# EasyEDA Pro project TFT_F1_2025-05-25_16-21-43.eprj

# Schematic Schematic1
Board Name: Board1; Create Date: 2025-05-25; Page Name: P1; Project Name: TFT_F1_2025-05-25_16-21-43; Schematic Name: Schematic1; Update Date: 2025-05-25; Company: 嘉立创EDA; Page Size: A4; Version: V1.0
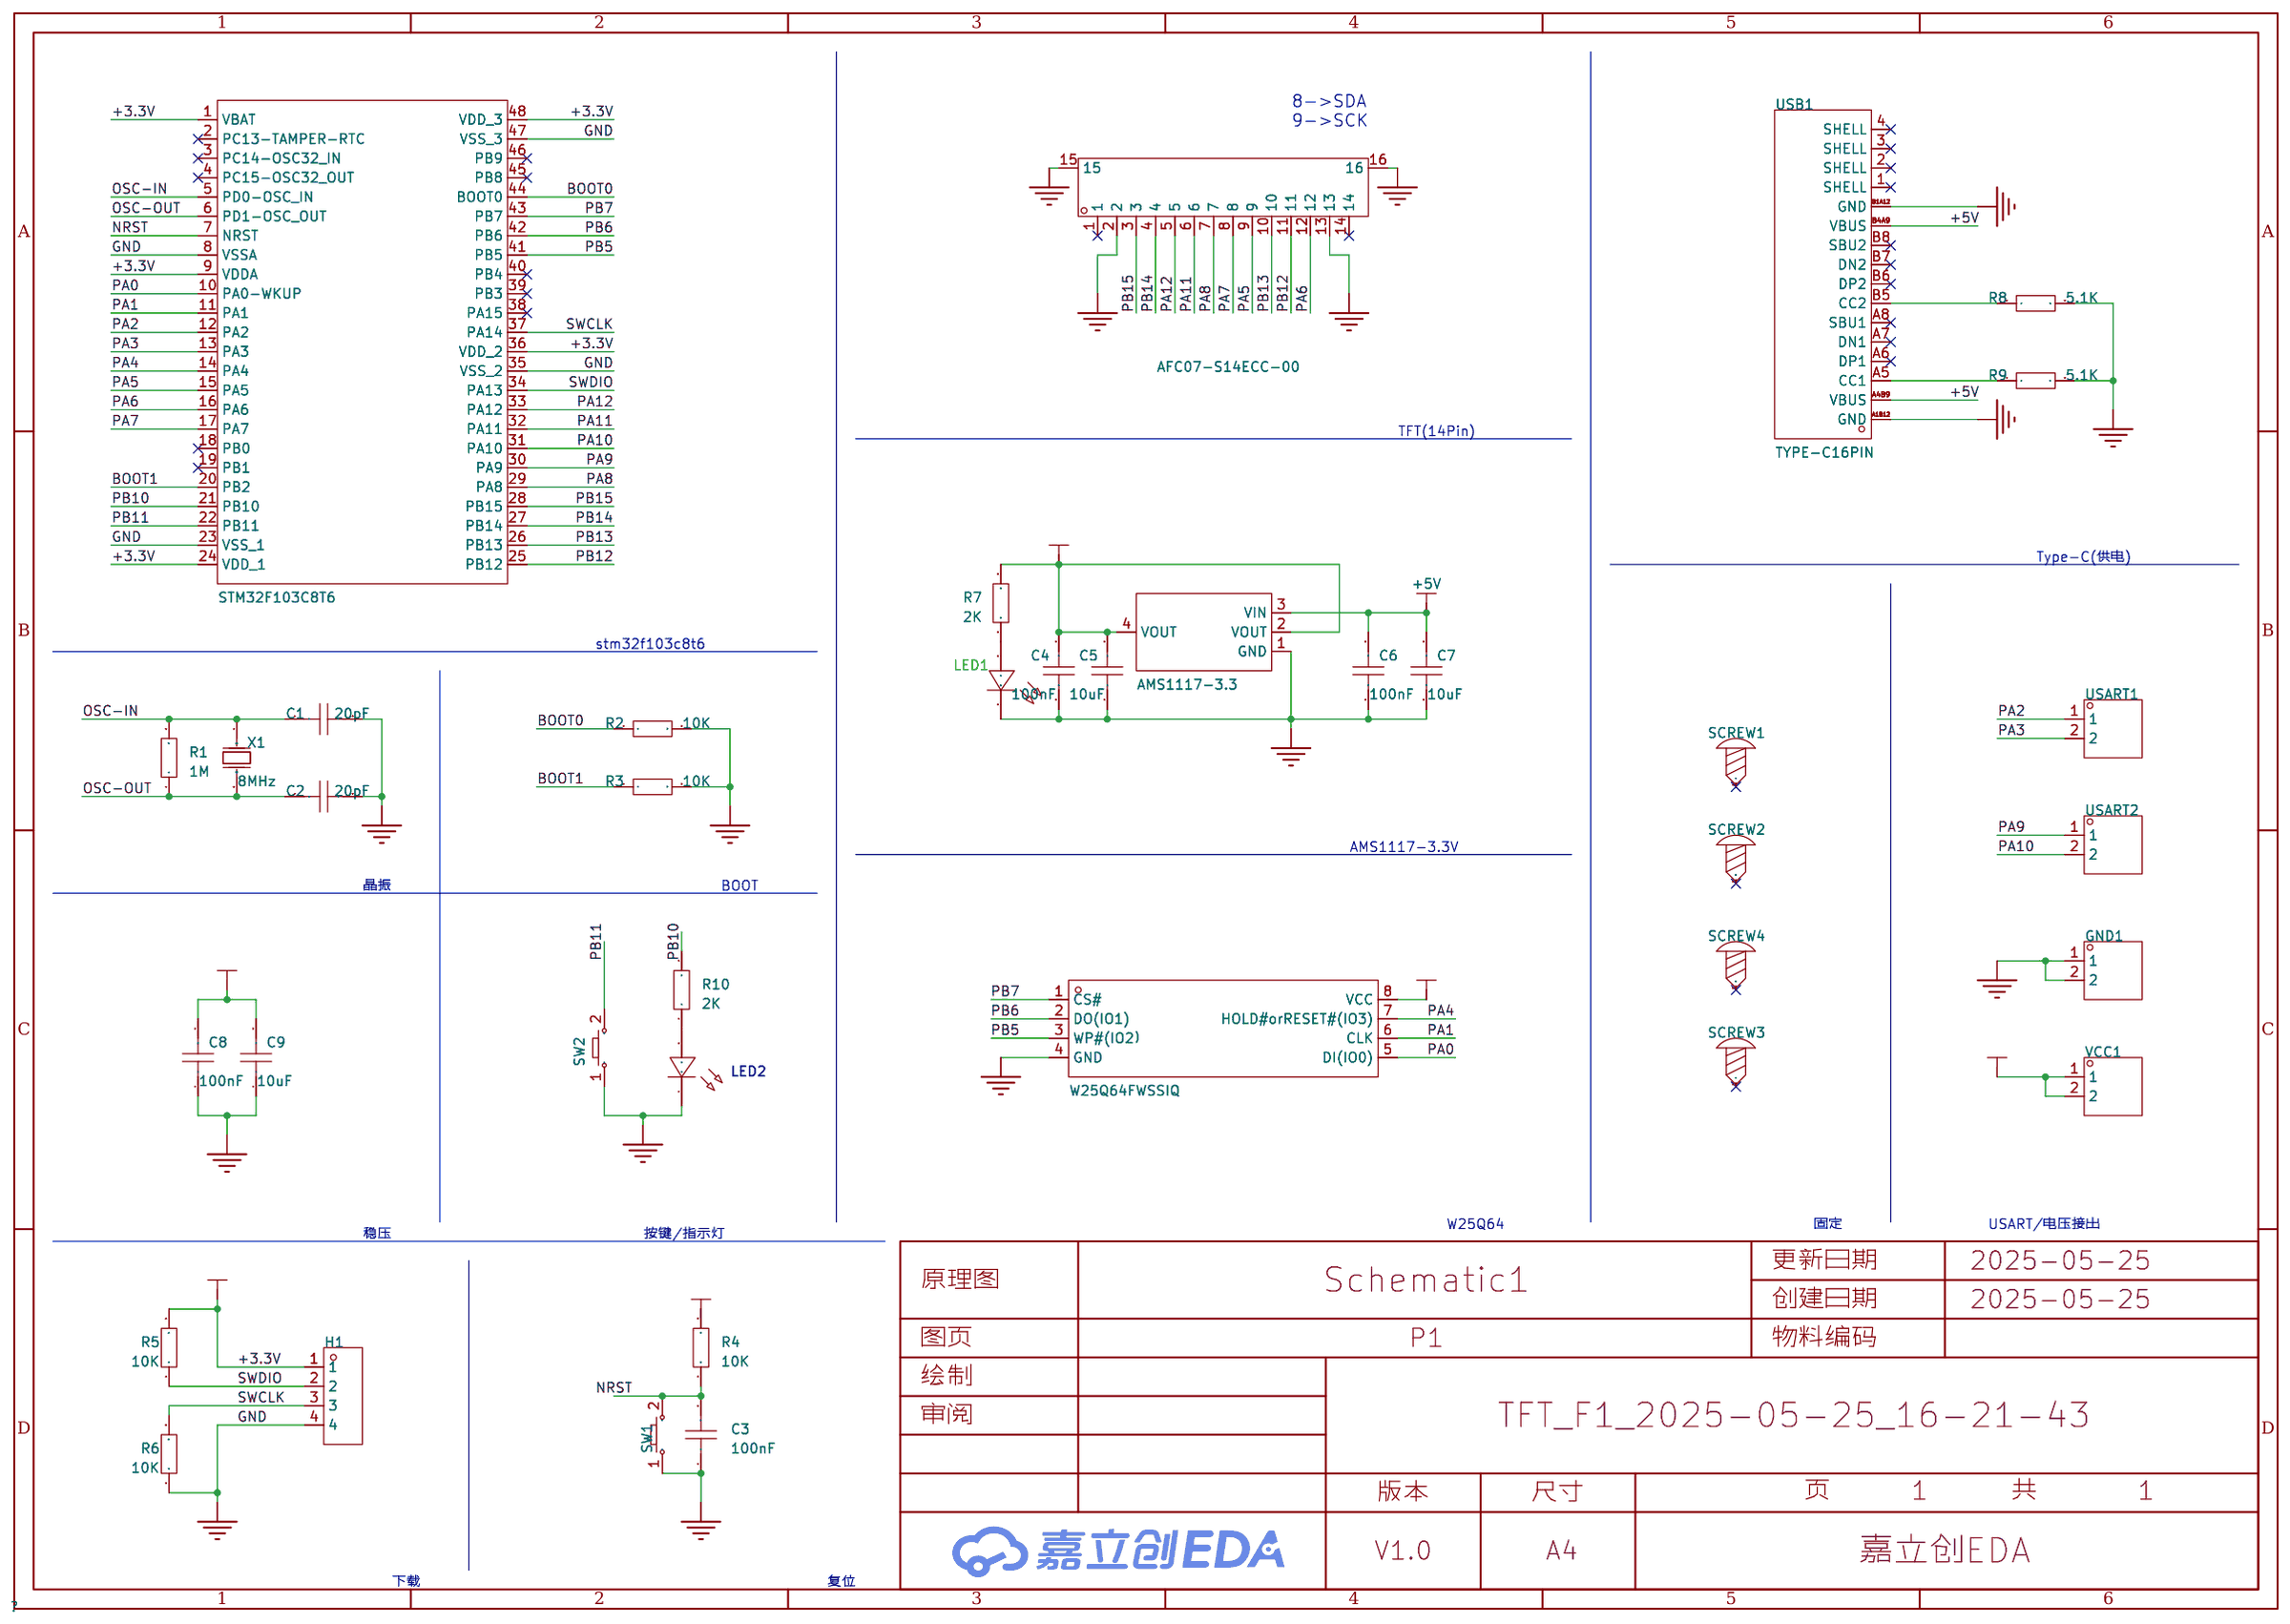
[diagram p0: schematic sheet]

## Parts
C1  20pF  [C0805]
C2  20pF  [C0805]
C3  100nF  [C0805]
C4  100nF  [C0805]
C5  10uF  [C0805]
C6  100nF  [C0805]
C7  10uF  [C0805]
C8  100nF  [C0805]
C9  10uF  [C0805]
GND1  -  [HDR-TH_2P-P2.54-V-M-1]
H1  -  [HDR-TH_4P-P2.54-V-M]
LED1  -  [LED_0805]
LED2  -  [LED_0805]
P1  AFC07-S14ECC-00  [FPC-SMD_14P-L12.5-W5.4-P0.50]
R1  1M  [R0805]
R2  10K  [R0805]
R3  10K  [R0805]
R4  10K  [R0805]
R5  10K  [R0805]
R6  10K  [R0805]
R7  2K  [R0805]
R8  5.1K  [R0805]
R9  5.1K  [R0805]
R10  2K  [R0805]
SCREW1  -  [M3螺丝]
SCREW2  -  [M3螺丝]
SCREW3  -  [M3螺丝]
SCREW4  -  [M3螺丝]
SW1  -  [Key_SMD_3x4x2]
SW2  -  [Key_SMD_3x4x2]
U1  STM32F103C8T6  [LQFP-48_L7.0-W7.0-P0.50-LS9.0-BL]
U2  AMS1117-3.3  [SOT-223-3_L6.5-W3.4-P2.30-LS7.0-BR]
U3  W25Q64FWSSIQ  [SOIC-8_L5.3-W5.3-P1.27-LS8.0-BL]
USART1  -  [HDR-TH_2P-P2.54-V-M-1]
USART2  -  [HDR-TH_2P-P2.54-V-M-1]
USB1  TYPE-C16PIN  [USB-C-SMD_TYPE-C16PIN]
VCC1  -  [HDR-TH_2P-P2.54-V-M-1]
X1  8MHz  [CRYSTAL-SMD_L11.5-W4.8-LS12.7]

## Library data of the parts
C1-C9 = CAP_0805: Supplier Footprint: 0805
GND1 USART1 USART2 VCC1 = HDR-M_2.54_1x2P: Supplier Part: C124375; Supplier Footprint: 插件
H1 = HDR-M_2.54_1x4P: Supplier Part: C492403; Supplier Footprint: 插件
LED1 = LED_0805-G: Supplier Footprint: 0805
LED2 = LED_0805-B: Supplier Footprint: 0805
P1 = AFC07-S14ECC-00: 锁定特性:抽屉式;触点类型:上接;触点数量:14P;间距:0.5mm;安装类型:卧贴;; LCSC Part Name: 间距:0.5mm P数:14P 抽屉式 上接; Supplier Part: C11087; Manufacturer: JS(钜硕电子); Supplier Footprint: SMD,P=0.5mm,卧贴; JLCPCB Part Class: 扩展库; Datasheet: https://atta.szlcsc.com/upload/public/pdf/source/20130129/1457706582878.pdf; Supplier: LCSC; Locking Feature: 抽屉式; Contact Type: 上接; Number of Contacts: 14P; Pitch: 0.5mm; Mounting Type: 卧贴; FFC, FCB Thickness: 0.3mm; Height Above Board: 2mm
R1-R4 R7-R10 = Res_0805: Supplier Footprint: 0805
R5 R6 = Res_0603: Supplier Footprint: 0603; Check: true
SCREW1-SCREW4 = M3螺丝: Supplier Footprint: 插件
SW1 SW2 = Key_SMD_3x4x2: Supplier Footprint: SMD
U1 = STM32F103C8T6_C9900100366: Supplier Part: C9900100366; Supplier Footprint: TH-6P; JLCPCB Part Class: 扩展库; Supplier: LCSC
U2 = AMS1117-3.3_C6186: LCSC Part Name: 输出3.3V 1A; Supplier Part: C6186; Manufacturer: AMS; Supplier Footprint: SOT-223; JLCPCB Part Class: 基础库; Datasheet: https://atta.szlcsc.com/upload/public/pdf/source/20180727/C6186_7A095716F0823C02F1997A905E26C086.pdf; Supplier: LCSC; Output Type: 固定; Output Voltage: 3.3V; Output Current: 1A; Power Supply Rejection Ratio (PSRR): 72dB@(120Hz); Voltage Dropout: 1.3V@(800mA); Features: 过流保护(OCP)；热关断(TSD); Output Configuration: 正极; Number of Outputs: 1
U3 = W25Q64FWSSIQ: Supplier Part: C783717; Manufacturer: WINBOND(华邦); Supplier Footprint: SOIC-8-208mil; JLCPCB Part Class: 扩展库; Datasheet: https://atta.szlcsc.com/upload/public/pdf/source/20200914/C783717_9592DB26B3553414A1014E6A69EB35F2.pdf; Supplier: LCSC
USB1 = TYPE-C16PIN: 连接器类型:Type-C;标准:USB 3.1;公母:母;安装方式:卧贴;触点数量:16P;端口数量:1;额定电流 - 电源:3A;工作温度范围:-40℃~+85℃;; LCSC Part Name: Type-C 母 卧贴; Supplier Part: C393939; Manufacturer: SHOU HAN(首韩); Supplier Footprint: SMD; JLCPCB Part Class: 扩展库; Datasheet: https://atta.szlcsc.com/upload/public/pdf/source/20190521/C393939_7B9043D4CF1026AF443AB60D91FBCD5C.pdf; Supplier: LCSC; Connector Type: Type-C; Standard: USB 3.1; Gender: 母; Mounting Style: 卧贴; Number of Contacts: 16P; Number of Ports: 1; Current Rating - Power (Max): 3A; Operating Temperature Range: -40℃~+85℃; Rated Voltage (Max): 30V; Connect-Disconnect Life: 1万次; Core Colour: 黑色; Check: true
X1 = X49SM8MSD2SC: 晶振类型:贴片晶振;频率:8MHz;常温频差:±20ppm;外接负载电容:20pF;频率稳定度(全温):±30ppm;; LCSC Part Name: 8MHz ±20ppm 20pF; Supplier Part: C12674; Manufacturer: YXC(扬兴晶振); Supplier Footprint: HC-49S-SMD; JLCPCB Part Class: 基础库; Datasheet: https://atta.szlcsc.com/upload/public/pdf/source/20240329/3EBF42EBCAB50CA65B6FA9D7CFA1955A.pdf; Supplier: LCSC; Crystal Type: 贴片晶振; Normal temperature Frequency Tolerance: ±20ppm; External load capacitor: 20pF; Frequency Stability(Full temperature range): ±30ppm; Operating Temperature: -20℃~+70℃; Check: true

## Nets
+3.3V: C4.2 C5.2 C8.2 C9.2 H1.1 R4.2 R5.2 R7.2 U1.1(VBAT) U1.9(VDDA) U1.24(VDD_1) U1.36(VDD_2) U1.48(VDD_3) U2.2(VOUT) U2.4(VOUT) U3.8(VCC) VCC1.1 VCC1.2
+5V: C6.2 C7.2 U2.3(VIN) USB1.A4B9(VBUS) USB1.B4A9(VBUS)
GND: C1.2 C2.2 C3.1 C4.1 C5.1 C6.1 C7.1 C8.1 C9.1 GND1.1 GND1.2 H1.4 LED1.1(C) LED2.1(C) P1.2 P1.13 P1.15 P1.16 R2.2 R3.2 R6.1 R8.2 R9.2 SW1.1 SW2.1 U1.8(VSSA) U1.23(VSS_1) U1.35(VSS_2) U1.47(VSS_3) U2.1(GND) U3.4(GND) USB1.A1B12(GND) USB1.B1A12(GND)
BOOT0: R2.1 U1.44(BOOT0)
BOOT1: R3.1 U1.20(PB2)
NRST: C3.2 R4.1 SW1.2 U1.7(NRST)
OSC-IN: C1.1 R1.2 U1.5(PD0-OSC_IN) X1.1(OSC1)
OSC-OUT: C2.1 R1.1 U1.6(PD1-OSC_OUT) X1.2(OSC2)
PA0: U1.10(PA0-WKUP) U3.5(DI(IO0))
PA1: U1.11(PA1) U3.6(CLK)
PA2: U1.12(PA2) USART1.1
PA3: U1.13(PA3) USART1.2
PA4: U1.14(PA4) U3.7(HOLD#orRESET#(IO3))
PA5: P1.9 U1.15(PA5)
PA6: P1.12 U1.16(PA6)
PA7: P1.8 U1.17(PA7)
PA8: P1.7 U1.29(PA8)
PA9: U1.30(PA9) USART2.1
PA10: U1.31(PA10) USART2.2
PA11: P1.6 U1.32(PA11)
PA12: P1.5 U1.33(PA12)
PB5: U1.41(PB5) U3.3(WP#(IO2）)
PB6: U1.42(PB6) U3.2(DO(IO1))
PB7: U1.43(PB7) U3.1(CS#)
PB10: R10.2 U1.21(PB10)
PB11: SW2.2 U1.22(PB11)
PB12: P1.11 U1.25(PB12)
PB13: P1.10 U1.26(PB13)
PB14: P1.4 U1.27(PB14)
PB15: P1.3 U1.28(PB15)
SWCLK: H1.3 R6.2 U1.37(PA14)
SWDIO: H1.2 R5.1 U1.34(PA13)
$1N2903: R9.1 USB1.A5(CC1)
$1N2904: R8.1 USB1.B5(CC2)
Net-(LED1-2): LED1.2(A) R7.1
Net-(LED2-2): LED2.2(A) R10.1

Not connected (* = marked no-connect by the designer): P1 1* 14*; SCREW1 1*; SCREW2 1*; SCREW3 1*; SCREW4 1*; U1 2(PC13-TAMPER-RTC)* 3(PC14-OSC32_IN)* 4(PC15-OSC32_OUT)* 18(PB0)* 19(PB1)* 38(PA15)* 39(PB3)* 40(PB4)* 45(PB8)* 46(PB9)*; USB1 1(SHELL)* 2(SHELL)* 3(SHELL)* 4(SHELL)* A6(DP1)* A7(DN1)* A8(SBU1)* B6(DP2)* B7(DN2)* B8(SBU2)*

## Notes on the sheet
- 8->SDA
  9->SCK
- TFT(14Pin)
- Type-C(供电)
- stm32f103c8t6
- AMS1117-3.3V
- 晶振
- BOOT
- W25Q64
- 固定
- USART/电压接出
- 稳压
- 按键/指示灯
- 下载
- 复位

# Board PCB1
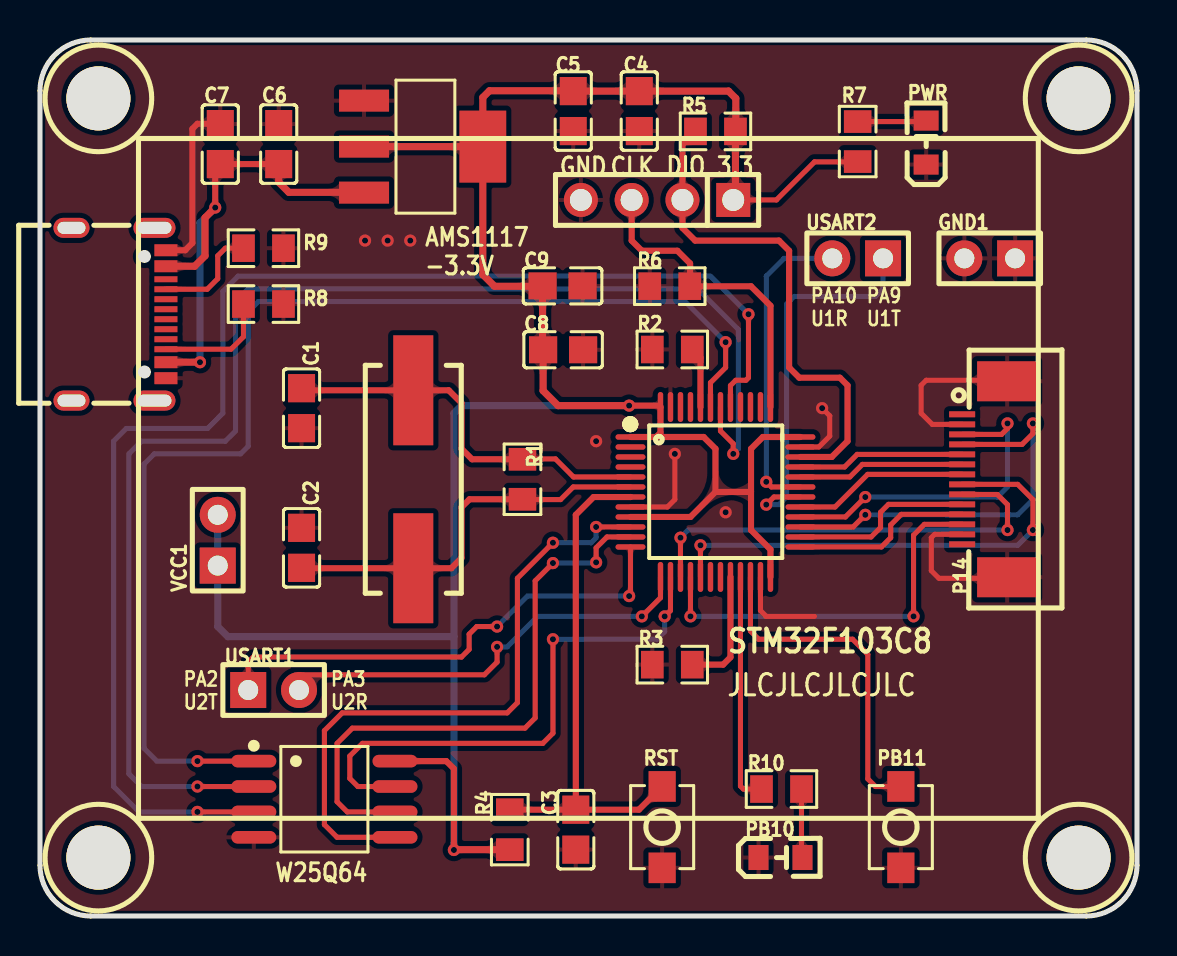
[diagram p1: board, top side]
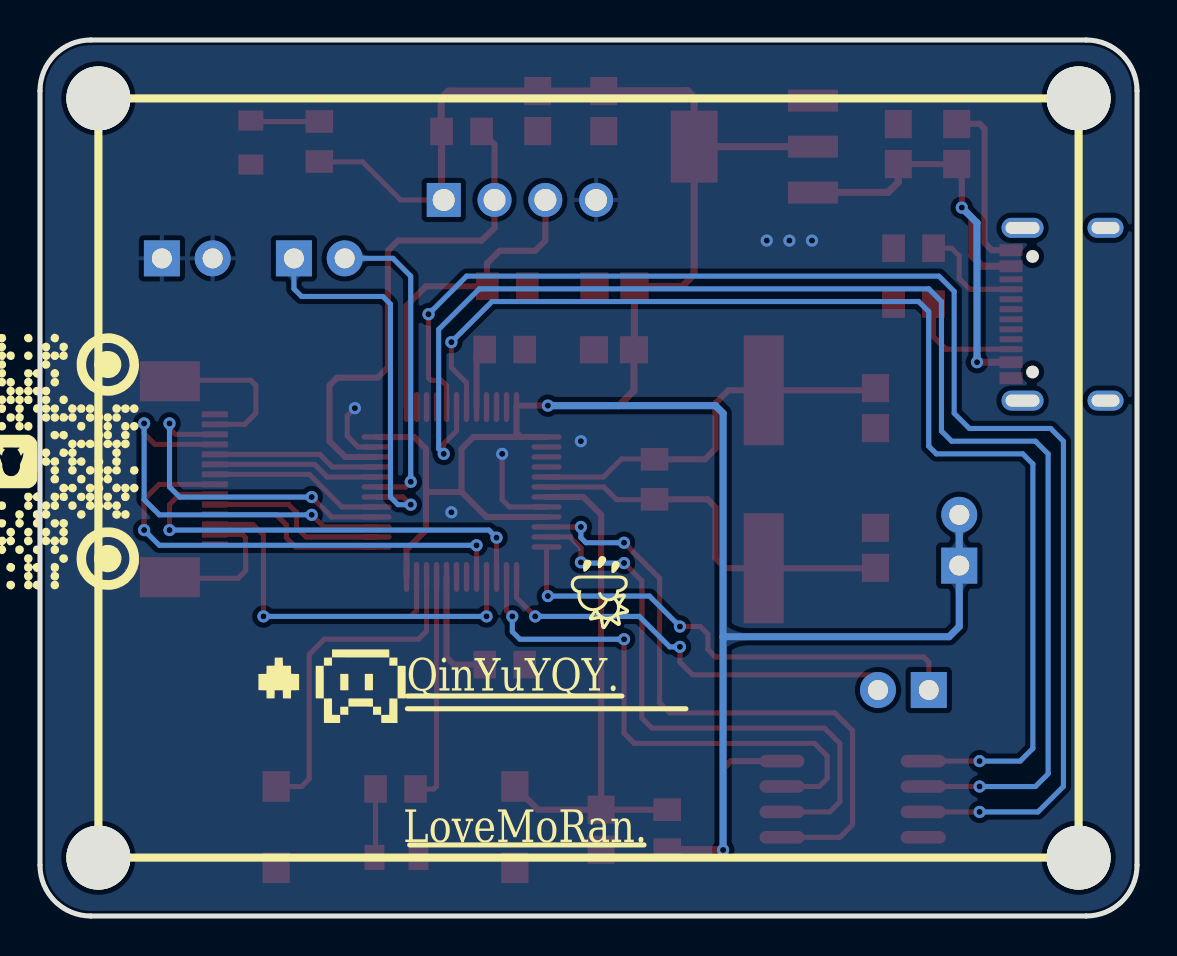
[diagram p2: board, bottom side, seen from below]

Outline 54.86 x 43.81 mm; copper layers: Top Layer, Bottom Layer. Coordinates in mm from the lower left corner of the outline.
Outline path: 0,41.27 0,2.54 arc(0.74,0.74) 2.54,0 52.32,0 arc(54.12,0.74) 54.86,2.54 54.86,41.27 arc(54.12,43.07) 52.32,43.81 2.54,43.81 arc(0.74,43.07) 0,41.27
Stack: Top Layer 0.035mm / Dielectric1 1.51mm FR4 er 4.5 / Bottom Layer 0.035mm

## Design rules (mm)
net OSC-IN: DP1
net OSC-OUT: DP1
template: 自定义配置
spacing copperThickness1oz (default): track to track 0.102, other pairs 0.152 to 0.3
spacing copperThickness2oz: track to track 0.203, other pairs 0.152 to 0.3
track width copperThickness1oz (default): min 0.127, default 0.254, max 2.54
track width copperThickness2oz: min 0.203, default 0.254, max 2.54
differential pair differentialPair (default): width min 0.127, default 0.254, max 2.54; gap min 0.152, default 0.152
via viaSize (default): diameter min 0.5, default 0.61, max 10; hole min 0.3, default 0.305, max 6.3

## Placement (name value [footprint] x y rotation side)
C1  20pF  [C0805]  13.08 25.4 270 top
C2  20pF  [C0805]  13.08 18.41 90 top
C3  100nF  [C0805]  26.8 4.32 90 top
C4  100nF  [C0805]  29.97 40.26 90 top
C5  10uF  [C0805]  26.67 40.26 90 top
C6  100nF  [C0805]  11.94 38.61 270 top
C7  10uF  [C0805]  9.02 38.61 270 top
C8  100nF  [C0805]  26.16 28.32 180 top
C9  10uF  [C0805]  26.14 31.52 180 top
GND1  -  [HDR-TH_2P-P2.54-V-M-1]  47.5 32.89 180 top
H1  -  [HDR-TH_4P-P2.54-V-M]  30.86 35.81 180 top
P14  AFC07-S14ECC-00  [FPC-SMD_14P-L12.5-W5.4-P0.50]  47.24 21.84 90 top
PB10  -  [LED_0805]  37.08 2.92 0 top
PB11  -  [Key_SMD_3x4x2]  43.05 4.44 90 top
PWR  -  [LED_0805]  44.32 38.73 90 top
R1  1M  [R0805]  24.13 21.84 90 top
R2  10K  [R0805]  31.62 28.33 180 top
R3  10K  [R0805]  31.62 12.57 180 top
R4  10K  [R0805]  23.5 4.32 270 top
R5  10K  [R0805]  33.78 39.24 0 top
R6  10K  [R0805]  31.5 31.5 0 top
R7  2K  [R0805]  40.89 38.73 270 top
R8  5.1K  [R0805]  11.18 30.61 0 top
R9  5.1K  [R0805]  11.18 33.4 0 top
R10  2K  [R0805]  37.08 6.35 180 top
RST  -  [Key_SMD_3x4x2]  31.12 4.44 90 top
SCREW1  -  [M3螺丝]  2.92 2.92 0 top
SCREW2  -  [M3螺丝]  2.92 40.89 0 top
SCREW3  -  [M3螺丝]  51.94 40.89 0 top
SCREW4  -  [M3螺丝]  51.94 2.92 0 top
U1  STM32F103C8T6  [LQFP-48_L7.0-W7.0-P0.50-LS9.0-BL]  33.78 21.21 270 top
U2  AMS1117-3.3  [SOT-223-3_L6.5-W3.4-P2.30-LS7.0-BR]  19.18 38.48 180 top
U3  W25Q64FWSSIQ  [SOIC-8_L5.3-W5.3-P1.27-LS8.0-BL]  14.22 5.84 270 top
USART1  -  [HDR-TH_2P-P2.54-V-M-1]  11.68 11.3 0 top
USART2  -  [HDR-TH_2P-P2.54-V-M-1]  40.89 32.89 180 top
USB1  TYPE-C16PIN  [USB-C-SMD_TYPE-C16PIN]  3.94 30.1 270 top
VCC1  -  [HDR-TH_2P-P2.54-V-M-1]  8.89 18.8 90 top
X1  8MHz  [CRYSTAL-SMD_L11.5-W4.8-LS12.7]  18.67 21.84 270 top

## Footprints (pads in the part's own frame, mm; a bottom-side part is the same pattern mirrored in y, then rotated)
C0805
  rect 1.41x1.35 smd: 1(-1,0) 2(1,0)
CRYSTAL-SMD_L11.5-W4.8-LS12.7
  rect 5.5x2 smd: 1(-4.45,0) 2(4.45,0)
FPC-SMD_14P-L12.5-W5.4-P0.50
  rect 0.3x1.3 smd: 1(3.249,1.125) 2(2.745,1.125) 3(2.245,1.125) 4(1.745,1.125) 5(1.245,1.125) 6(0.745,1.125) 7(0.245,1.125) 8(-0.255,1.125) 9(-0.755,1.125) 10(-1.255,1.125) 11(-1.755,1.125) 12(-2.255,1.125) 13(-2.755,1.125) 14(-3.255,1.125)
  rect 2x3 smd: 15(-4.901,-1.125) 16(4.901,-1.125)
HDR-TH_2P-P2.54-V-M-1
  rect 1.8x1.8 hole 1: 1(-1.27,0)
  round 1.8 hole 1: 2(1.27,0)
HDR-TH_4P-P2.54-V-M
  rect 1.7x1.7 hole 1.1: 1(-3.81,0)
  round 1.7 hole 1.1: 2(-1.27,0) 3(1.27,0) 4(3.81,0)
Key_SMD_3x4x2
  rect 1.53x1.36 smd: 1(-2.035,0) 2(2.035,0)
LED_0805
  rect 1x1.25 smd: 1(-1.15,0.005) 2(1.05,0.005)
LQFP-48_L7.0-W7.0-P0.50-LS9.0-BL
  oval 0.27x1.5 smd: 1(-2.75,-4.25) 2(-2.25,-4.25) 3(-1.75,-4.25) 4(-1.25,-4.25) 5(-0.75,-4.25) 6(-0.25,-4.25) 7(0.25,-4.25) 8(0.75,-4.25) 9(1.25,-4.25) 10(1.75,-4.25) 11(2.25,-4.25) 12(2.75,-4.25) 25(2.75,4.25) 26(2.25,4.25) 27(1.75,4.25) 28(1.25,4.25) 29(0.75,4.25) 30(0.25,4.25) 31(-0.25,4.25) 32(-0.75,4.25) 33(-1.25,4.25) 34(-1.75,4.25) 35(-2.25,4.25) 36(-2.75,4.25)
  oval 1.5x0.27 smd: 13(4.25,-2.75) 14(4.25,-2.25) 15(4.25,-1.75) 16(4.25,-1.25) 17(4.25,-0.75) 18(4.25,-0.25) 19(4.25,0.25) 20(4.25,0.75) 21(4.25,1.25) 22(4.25,1.75) 23(4.25,2.25) 24(4.25,2.75) 37(-4.25,2.75) 38(-4.25,2.25) 39(-4.25,1.75) 40(-4.25,1.25) 41(-4.25,0.75) 42(-4.25,0.25) 43(-4.25,-0.25) 44(-4.25,-0.75) 45(-4.25,-1.25) 46(-4.25,-1.75) 47(-4.25,-2.25) 48(-4.25,-2.75)
M3螺丝
  round 3.2 hole 3.2: 1(0,0)
R0805
  rect 1.133x1.377 smd: 1(-1,0) 2(1,0)
SOIC-8_L5.3-W5.3-P1.27-LS8.0-BL
  oval 0.63x2.25 smd: 1(-1.905,-3.53) 2(-0.635,-3.53) 3(0.635,-3.53) 4(1.905,-3.53) 5(1.905,3.53) 6(0.635,3.53) 7(-0.635,3.53) 8(-1.905,3.53)
SOT-223-3_L6.5-W3.4-P2.30-LS7.0-BR
  rect 2.5x1.1 smd: 1(2.97,-2.3) 2(2.97,0) 3(2.97,2.3)
  rect 2.34x3.6 smd: 4(-2.97,0)
USB-C-SMD_TYPE-C16PIN
  oval 1x2.1 hole 0.6x1.7: 1(-4.32,1.788) 2(4.32,1.788)
  oval 1x1.8 hole 0.6x1.4: 3(-4.32,-2.362) 4(4.32,-2.362)
  rect 0.6x1.15 smd: A1B12(-3.2,2.362) A4B9(-2.4,2.362) B1A12(3.2,2.362) B4A9(2.4,2.362)
  rect 0.3x1.15 smd: A5(-1.25,2.362) A6(-0.25,2.362) A7(0.25,2.362) A8(1.25,2.362) B5(1.75,2.362) B6(0.75,2.362) B7(-0.75,2.362) B8(-1.75,2.362)

## Nets
+3.3V: C4.2 C5.2 C8.2 C9.2 H1.1 R4.2 R5.2 R7.2 U1.1 U1.9 U1.24 U1.36 U1.48 U2.2 U2.4 U3.8 VCC1.1 VCC1.2
+5V: C6.2 C7.2 U2.3 USB1.A4B9 USB1.B4A9
GND: C1.2 C2.2 C3.1 C4.1 C5.1 C6.1 C7.1 C8.1 C9.1 GND1.1 GND1.2 H1.4 P14.2 P14.13 P14.15 P14.16 PB10.1 PB11.1 PWR.1 R2.2 R3.2 R6.1 R8.2 R9.2 RST.1 U1.8 U1.23 U1.35 U1.47 U2.1 U3.4 USB1.A1B12 USB1.B1A12
BOOT0: R2.1 U1.44
BOOT1: R3.1 U1.20
NRST: C3.2 R4.1 RST.2 U1.7
OSC-IN: C1.1 R1.2 U1.5 X1.1
OSC-OUT: C2.1 R1.1 U1.6 X1.2
PA0: U1.10 U3.5
PA1: U1.11 U3.6
PA2: U1.12 USART1.1
PA3: U1.13 USART1.2
PA4: U1.14 U3.7
PA5: P14.9 U1.15
PA6: P14.12 U1.16
PA7: P14.8 U1.17
PA8: P14.7 U1.29
PA9: U1.30 USART2.1
PA10: U1.31 USART2.2
PA11: P14.6 U1.32
PA12: P14.5 U1.33
PB0: U1.18
PB1: U1.19
PB5: U1.41 U3.3
PB6: U1.42 U3.2
PB7: U1.43 U3.1
PB8: U1.45
PB9: U1.46
PB10: R10.2 U1.21
PB11: PB11.2 U1.22
PB12: P14.11 U1.25
PB13: P14.10 U1.26
PB14: P14.4 U1.27
PB15: P14.3 U1.28
PC13: U1.2
SWCLK: H1.3 R6.2 U1.37
SWDIO: H1.2 R5.1 U1.34
$1N2903: R9.1 USB1.A5
$1N2904: R8.1 USB1.B5
$1N3064: PB10.2 R10.1
$1N3196: PWR.2 R7.1

Pads without a net: P14 1 14; SCREW1 1; SCREW2 1; SCREW3 1; SCREW4 1; U1 3 4 38 39 40; USB1 1 2 3 4 A6 A7 A8 B6 B7 B8

## Via types
v1: diameter 0.61, hole 0.305, Top Layer to Bottom Layer, 39 vias

## Routing (per net, layer and track width the routed paths; a pad name or vN(x,y) marks a point on that pad's centre or on a via; arc(x,y) is an arc through that point)
+3.3V: length 137.3
  Top Layer w0.254: H1.1 36.83,35.81 38.74,37.72 40.88,37.72 R7.2
  Top Layer w0.305: U1.9 32.53,19.96 33.78,21.21 ; 30.82,23.96 33.19,23.96 33.78,23.37 33.78,21.21 ; 30.82,23.96 31.03,24.17 U1.48 30.96,25.53 v1(29.46,25.53) ; 30.82,23.96 U1.1 ; U3.8 20.32,7.75 20.7,7.37 v1(20.7,3.3) ; 33.78,21.21 35.54,21.21 35.56,21.23 ; 35.56,21.23 35.56,19.3 36.53,18.33 U1.24 ; 35.56,21.23 35.56,23.37 36.15,23.96 U1.36
  Top Layer w0.355: U2.2 U2.4 ; U2.4 22.15,40.94 22.48,41.27 26.65,41.27 C5.2 C4.2 34.43,41.26 34.8,40.89 34.8,39.26 R5.2 34.78,35.92 H1.1 ; U2.4 22.15,32.08 22.73,31.5 25.12,31.5 C9.2 25.14,28.35 C8.2 25.16,26.27 25.91,25.53 v1(29.46,25.53) ; R4.2 20.72,3.32 v1(20.7,3.3)
  Bottom Layer w0.355: v1(29.46,25.53) 21.08,25.53 20.7,25.15 20.7,13.97 ; 8.89,20.07 VCC1.1 8.89,14.48 9.4,13.97 20.7,13.97 20.7,13.97 ; 20.7,13.97 v1(20.7,3.3)
+5V: length 25.1
  Top Layer w0.305: C6.2 C7.2 8.76,37.35 v1(8.76,35.43)
  Top Layer w0.355: C6.2 11.94,36.7 12.45,36.19 16.19,36.19 U2.3 ; USB1.A4B9 7.73,32.5 8.25,33.02 8.25,34.92 v1(8.76,35.43) ; USB1.B4A9 v1(8,27.7)
  Bottom Layer w0.355: v1(8.76,35.43) 8,34.67 v1(8,27.7)
GND: length 36.4
  Top Layer w0.254: P14.2 44.63,24.59 44.07,25.15 44.07,26.54 44.32,26.8 48.32,26.8 P14.16 ; U1.35 38.95,23.46 39.5,24 39.5,25.02 v1(39.12,25.4) ; P14.13 44.74,19.09 44.58,18.92 44.58,17.27 44.96,16.89 48.32,16.89 P14.15 ; 38.74,14.99 36.32,14.99 36.03,15.28 U1.23 ; U1.8 31.38,20.46 31.75,20.83 v1(31.75,23.11)
  Top Layer w0.305: USB1.A1B12 7.26,33.3 7.62,33.66 7.62,39.37 7.87,39.62 9,39.62 C7.1
  vias: v1(16.26,33.78) v1(17.39,33.78) v1(18.52,33.78) v1(27.81,23.75) v1(34.29,20.19)
BOOT0: length 3
  Top Layer w0.305: R2.1 33.03,27.93 U1.44
BOOT1: length 6.1
  Top Layer w0.305: U1.20 34.53,12.94 34.16,12.57 R3.1
NRST: length 26
  Top Layer w0.305: C3.2 29.95,5.32 RST.2 ; C3.2 26.8,20.07 27.69,20.95 29.53,20.95 U1.7 ; C3.2 R4.1
OSC-IN: length 19.6
  Top Layer w0.254: R1.2 24.15,22.86 25.78,22.86 26.68,21.96 U1.5
  Top Layer w0.305: C1.1 13.19,26.29 X1.1 20.44,26.29 21.08,25.65 21.08,23.37 21.61,22.84 R1.2
OSC-OUT: length 19.6
  Top Layer w0.254: R1.1 24.15,20.83 26.03,20.83 26.67,21.46 U1.6
  Top Layer w0.305: R1.1 21.48,20.84 21.08,20.45 21.08,17.91 20.57,17.39 X1.2 13.1,17.39 C2.1
PA0: length 32
  Top Layer w0.254: U3.5 14.86,3.94 14.22,4.57 14.22,9.27 15.11,10.16 23.37,10.16 23.88,10.67 23.88,16.89 v1(25.65,18.67) ; U1.10 v1(27.81,19.46)
  Bottom Layer w0.254: v1(27.81,19.46) 27.81,18.92 27.56,18.67 v1(25.65,18.67)
PA1: length 29.4
  Top Layer w0.254: v1(27.81,17.69) 27.81,18.41 28.36,18.96 U1.11 ; U3.6 15.37,5.21 14.86,5.72 14.86,8.64 15.62,9.4 24.26,9.4 24.76,9.91 24.76,16.76 v1(25.65,17.65)
  Bottom Layer w0.254: v1(27.81,17.69) 27.78,17.65 v1(25.65,17.65)
PA2: length 24
  Top Layer w0.254: v1(29.46,16) 29.53,16.07 U1.12 ; 22.73,14.48 21.84,14.48 21.46,14.1 21.46,13.33 21.08,12.95 10.67,12.95 10.41,12.7 10.41,12.06
  Bottom Layer w0.254: v1(29.46,16) 24.38,16 v1(22.86,14.48) 22.73,14.48
PA3: length 21.2
  Top Layer w0.254: v1(22.86,13.46) 22.86,12.7 22.22,12.06 12.95,12.06 ; U1.13 31.03,15.92 v1(30.1,14.99)
  Bottom Layer w0.254: v1(22.86,13.46) 23.37,13.46 24.89,14.99 v1(30.1,14.99)
PA4: length 27.5
  Top Layer w0.254: U3.7 15.9,6.48 15.49,6.88 15.49,8 16.13,8.64 25.15,8.64 25.65,9.14 v1(25.65,13.84) ; v1(31.24,14.99) 31.53,15.28 U1.14
  Bottom Layer w0.254: v1(31.24,14.99) 31.24,14.22 30.86,13.84 v1(25.65,13.84)
PA5: length 22.2
  Top Layer w0.254: v1(48.39,19.3) 48.39,20.57 47.88,21.08 46.13,21.08 P14.9 ; U1.15 v1(32.03,18.92)
  Bottom Layer w0.254: v1(48.39,19.3) 32.41,19.3 v1(32.03,18.92)
PA6: length 19.8
  Top Layer w0.254: P14.12 44.23,19.59 43.69,19.05 v1(43.69,14.99) ; U1.16 v1(32.53,14.99)
  Bottom Layer w0.254: v1(32.53,14.99) v1(43.69,14.99)
PA7: length 23.9
  Top Layer w0.254: U1.17 v1(33.03,18.54) ; 46.12,21.59 48.9,21.59 49.66,20.83 v1(49.66,19.3)
  Bottom Layer w0.254: v1(33.03,18.54) 48.9,18.54 v1(49.66,19.3)
PA8: length 8.8
  Top Layer w0.254: P14.7 41.39,22.09 39.76,20.46 U1.29
PA9: length 19.4
  Top Layer w0.254: U1.30 36.71,20.96 v1(36.32,20.57)
  Bottom Layer w0.254: v1(36.32,20.57) 36.96,20.57 37.34,20.95 37.34,30.61 37.72,30.99 41.78,30.99 42.16,31.37 USART2.1
PA10: length 15.8
  Top Layer w0.254: U1.31 36.58,21.46 v1(36.32,21.72)
  Bottom Layer w0.254: v1(36.32,21.72) 36.32,32 37.21,32.89 USART2.2
PA11: length 8.3
  Top Layer w0.254: P14.6 41.13,22.59 40.5,21.96 U1.32
PA12: length 8.3
  Top Layer w0.254: U1.33 40.24,22.46 40.87,23.09 P14.5
PB5: length 69.6
  Top Layer w0.254: U1.41 34.53,26.53 34.8,26.8 35.31,26.8 35.43,26.92 v1(35.43,30.1) ; v1(7.87,5.21) U3.3
  Bottom Layer w0.254: v1(7.87,5.21) 4.95,5.21 3.68,6.48 3.68,23.75 4.32,24.38 8.38,24.38 9.14,25.15 9.14,31.24 9.91,32 33.53,32 v1(35.43,30.1)
PB6: length 70
  Top Layer w0.254: U1.42 34.03,24.26 34.67,23.62 v1(34.67,23.11) ; v1(7.87,6.48) U3.2
  Bottom Layer w0.254: v1(34.67,23.11) 34.93,23.37 34.93,29.34 32.89,31.37 10.41,31.37 9.78,30.73 9.78,24.26 9.27,23.75 5.08,23.75 4.44,23.11 4.44,7.11 5.08,6.48 v1(7.87,6.48)
PB7: length 60.8
  Top Layer w0.254: v1(34.29,28.7) 34.29,27.43 33.53,26.67 U1.43 ; v1(7.87,7.75) U3.1
  Bottom Layer w0.254: v1(7.87,7.75) 5.84,7.75 5.21,8.38 5.21,22.61 5.72,23.11 10.03,23.11 10.41,23.5 10.41,30.23 10.92,30.73 32.26,30.73 v1(34.29,28.7)
PB10: length 11.6
  Top Layer w0.254: R10.2 35.18,6.35 35.03,6.5 U1.21
PB11: length 17.1
  Top Layer w0.254: U1.22 35.53,14.25 35.94,13.84 40.64,13.84 41.4,13.08 41.4,6.86 41.78,6.48 43.05,6.48 PB11.2
PB12: length 9.1
  Top Layer w0.254: P14.11 43.08,20.09 42.54,19.56 42.54,18.92 42.08,18.46 U1.25
PB13: length 9.2
  Top Layer w0.254: U1.26 41.56,18.96 42.04,19.43 42.04,20.19 42.43,20.59 P14.10
PB14: length 20.3
  Top Layer w0.254: v1(49.66,24.64) 49.66,24.13 49.12,23.59 P14.4 ; v1(41.28,20.07) 40.67,19.46 U1.27
  Bottom Layer w0.254: v1(41.28,20.07) 48.9,20.07 49.66,20.83 v1(49.66,24.64)
PB15: length 16.8
  Top Layer w0.254: v1(41.28,20.95) 40.28,19.96 U1.28 ; v1(48.39,24.64) 48.39,24.38 48.09,24.09 P14.3
  Bottom Layer w0.254: v1(48.39,24.64) 48.39,21.46 47.88,20.95 v1(41.28,20.95)
SWCLK: length 16.1
  Top Layer w0.305: 29.59,35.81 29.59,33.78 30.1,33.27 31.88,33.27 32.51,32.64 32.51,31.52 R6.2 32.5,31.5 35.56,31.5 36.53,30.52 U1.37
SWDIO: length 25.5
  Top Layer w0.305: U1.34 39.6,22.96 40.39,23.75 40.39,26.54 40,26.92 37.97,26.92 37.47,27.43 37.47,33.27 36.96,33.78 32.77,33.78 32.13,34.42 H1.2 32.13,38.59 R5.1
$1N2903: length 5.4
  Top Layer w0.254: USB1.A5 8.36,31.35 8.89,31.88 8.89,33.02 9.27,33.4 R9.1
$1N2904: length 5.8
  Top Layer w0.254: R8.1 10.18,28.97 9.55,28.35 USB1.B5
$1N3064: length 3.4
  Top Layer w0.254: 38.13,2.93 38.08,2.98 R10.1
$1N3196: length 3.4
  Top Layer w0.254: R7.1 44.27,39.73 PWR.2

## Copper pours and planes (outline as drawn; the poured copper is in the pictures)
GND on Top Layer: 0,43.81 54.86,43.81 54.86,0 0,0
GND on Bottom Layer: 0,43.81 54.86,43.81 54.86,0 0,0

Small or netless copper shapes (teardrops, artwork), in the pictures only: 144 on Top Layer, 38 on Bottom Layer

## Text on the board
Bottom Silkscreen Layer: QinYuYQY. | LoveMoRan.
Top Silkscreen Layer: PA2 / U2T | PA3 / U2R | PA10 / U1R | PA9 / U1T | W25Q64 | AMS1117 / -3.3V | GND | CLK | DIO | 3.3 | JLCJLCJLCJLC | STM32F103C8
